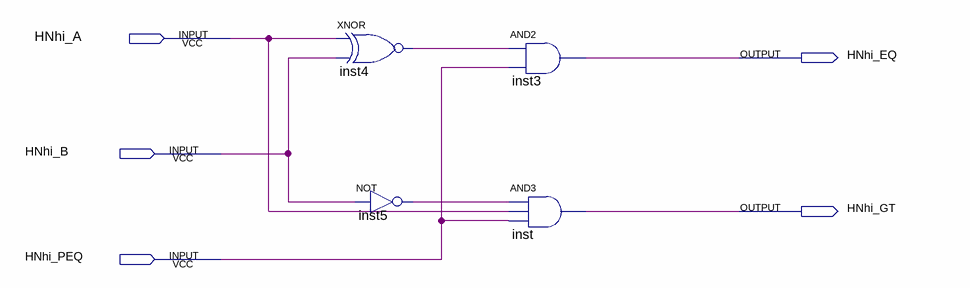
[diagram p0: schematic sheet]
// Quartus schematic gt.bdf as structural Verilog: 4 symbols, 5 pins
module gt (
  input  HNhi_A,
  input  HNhi_B,
  input  HNhi_PEQ,
  output HNhi_EQ,
  output HNhi_GT
);

  wire inst4_out, inst5_out;

  xnor inst4 (inst4_out, HNhi_A, HNhi_B);
  not inst5 (inst5_out, HNhi_B);
  and inst3 (HNhi_EQ, inst4_out, HNhi_PEQ);
  and inst (HNhi_GT, inst5_out, HNhi_A, HNhi_PEQ);
endmodule
